# Altium schematic sheet RTL - ETH PHY.SchDoc: ETHERNET SWITCH LAYER 2
size A3; DrawnBy: Luca Schenetti; Revision: C; SheetNumber: 4; SheetTotal: 5
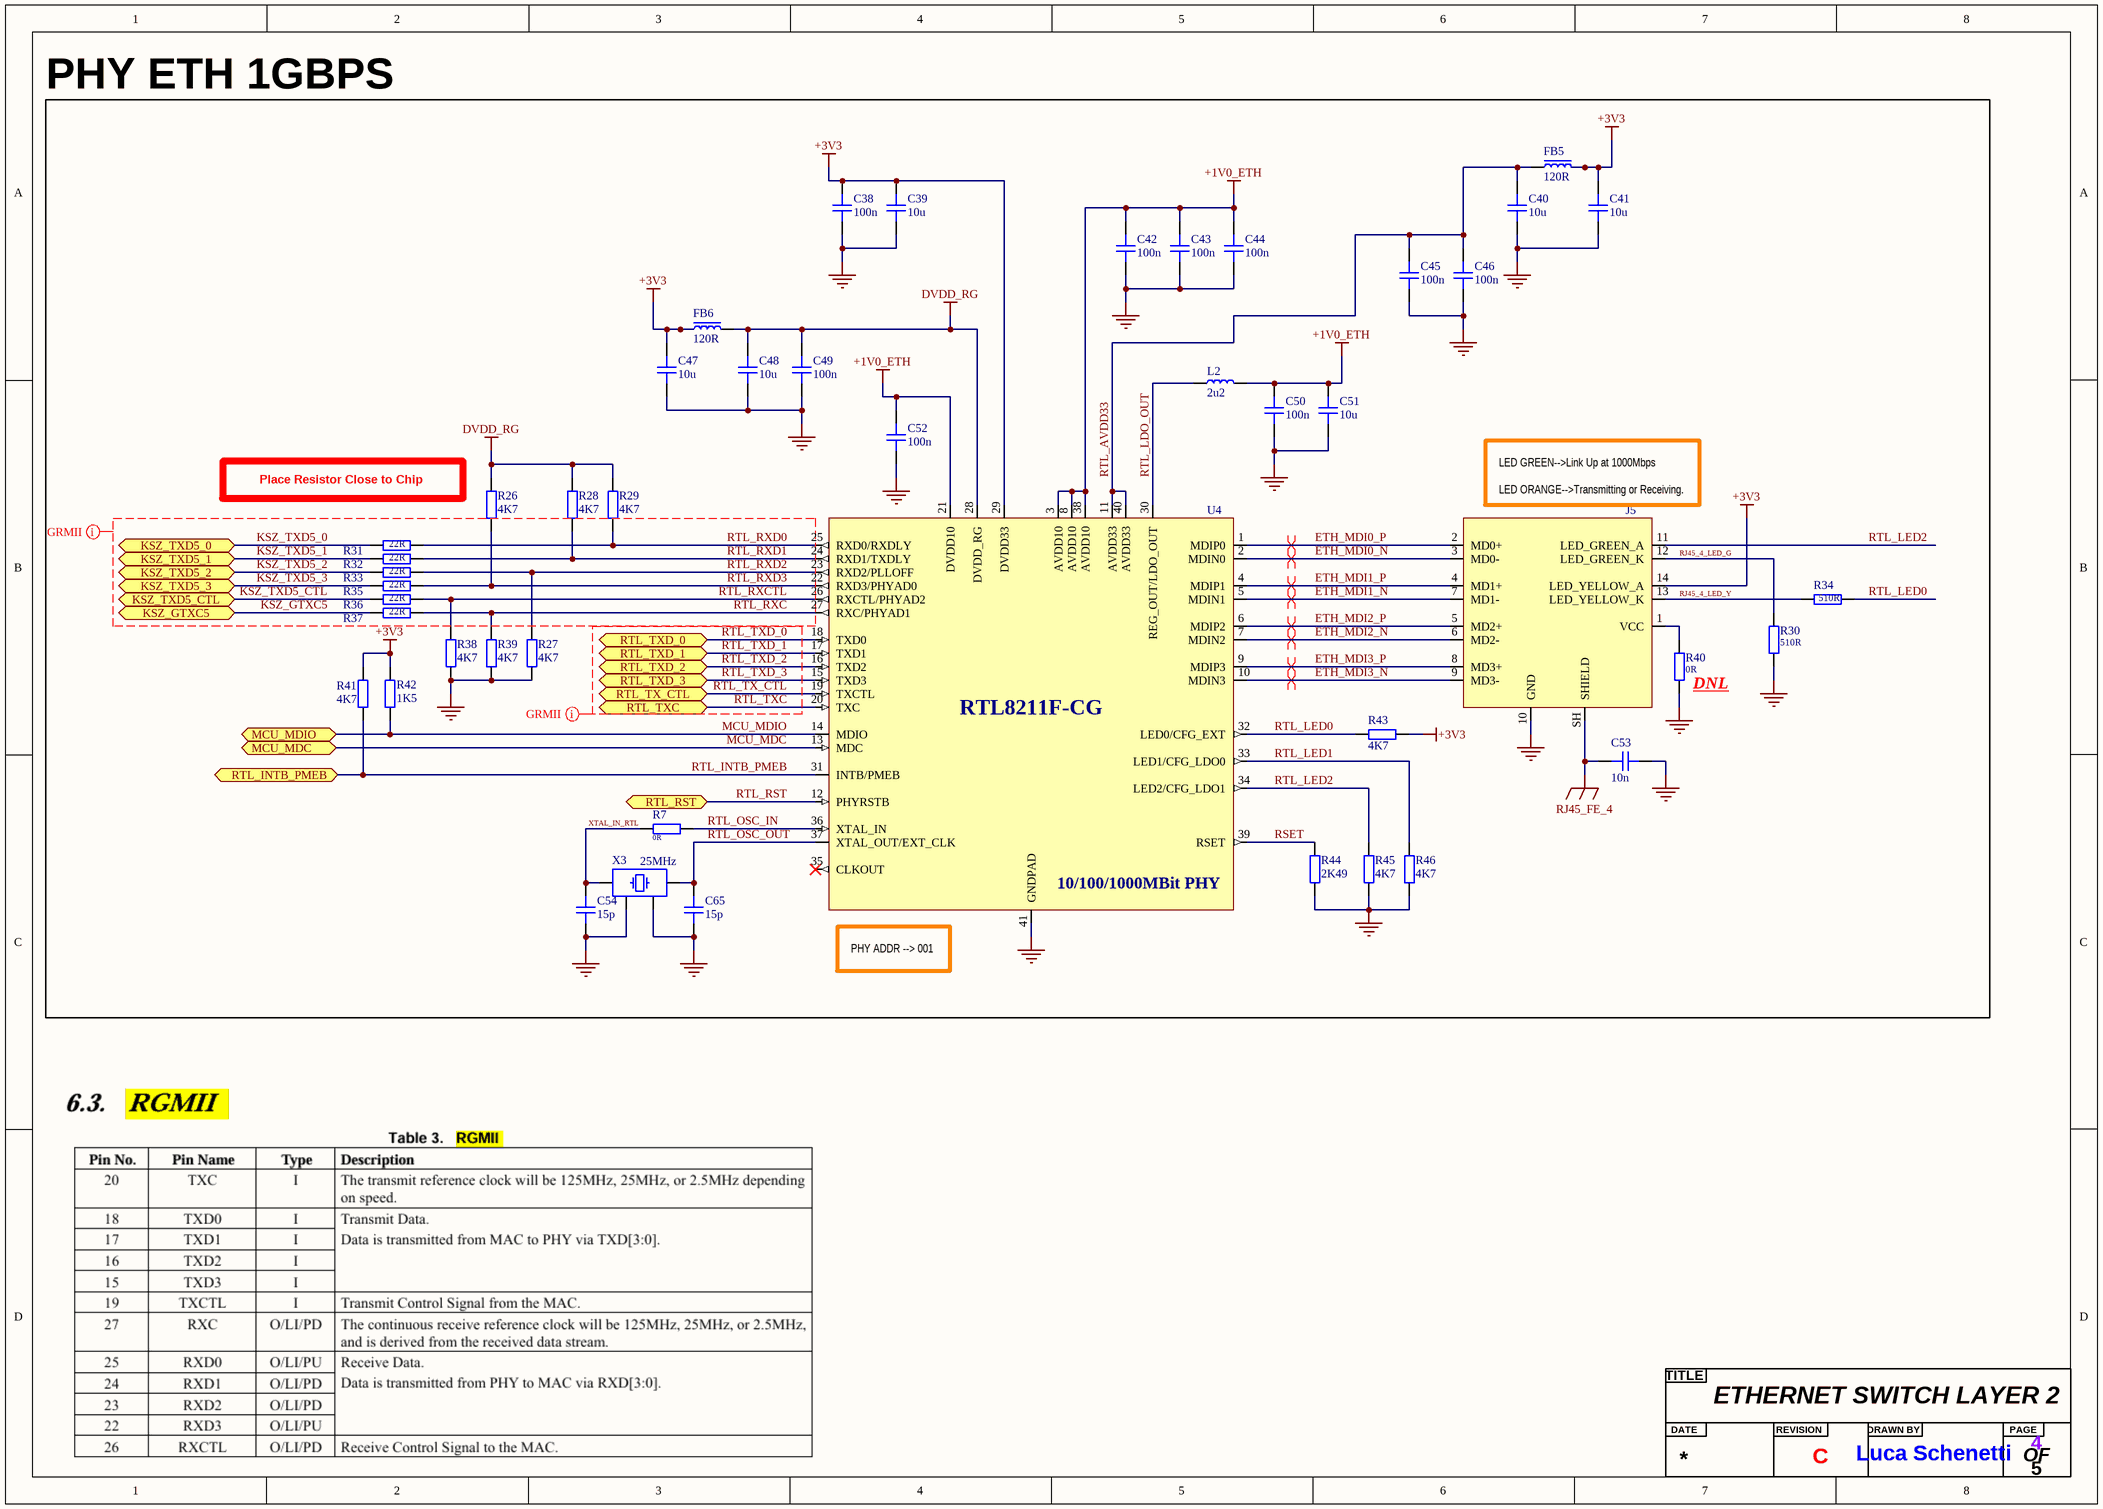
[diagram p0: RTL - ETH PHY.SchDoc]

## Parts
?  Title  (value not drawn)  (graphical)
C38  100n  [CAP_0603]
C39  10u  [CAP_0603]
C40  10u  [CAP_0603]
C41  10u  [CAP_0603]
C42  100n  [CAP_0603]
C43  100n  [CAP_0603]
C44  100n  [CAP_0603]
C45  100n  [CAP_0603]
C46  100n  [CAP_0603]
C47  10u  [CAP_0603]
C48  10u  [CAP_0603]
C49  100n  [CAP_0603]
C50  100n  [CAP_0603]
C51  10u  [CAP_0603]
C52  100n  [CAP_0603]
C53  10n  [CAP_1206]
C54  15p  [CAP_0402]
C65  15p  [CAP_0402]
FB5  120R  [FB_0603]
FB6  120R  [FB_0603]
J5  100/1000Base-T RJ45 MAGJACK  [HR911130A]  (value not drawn)
L2  2u2  [IND_1008]
R7  0R  [RES_0402]
R26  4K7  [RES_0402]
R27  4K7  [RES_0402]
R28  4K7  [RES_0402]
R29  4K7  [RES_0402]
R30  510R  [RES_0603]
R31  22R  [RES_0402]
R32  22R  [RES_0402]
R33  22R  [RES_0402]
R34  510R  [RES_0603]
R35  22R  [RES_0402]
R36  22R  [RES_0402]
R37  22R  [RES_0402]
R38  4K7  [RES_0402]
R39  4K7  [RES_0402]
R40  0R  [RES_0402]
R41  4K7  [RES_0603]
R42  1K5  [RES_0603]
R43  4K7  [RES_0603]
R44  2K49  [RES_0603]
R45  4K7  [RES_0603]
R46  4K7  [RES_0603]
U4  PHY ETH 10/100/1000M  [RTL8211F-CG]  (value not drawn)
X3  25MHz  [XTAL_3225]

## Blocks framed on the sheet
PHY ETH 1GBPS: C38-C54 C65 FB5 FB6 J5 L2 R7 R26-R46 U4 X3

## Ports
KSZ_GTXC5 (bidir, see KSZ - ETH HUB[2B]), KSZ_TXD5_0 (bidir, see KSZ - ETH HUB[2B]), KSZ_TXD5_1 (bidir, see KSZ - ETH HUB[2B]), KSZ_TXD5_2 (bidir, see KSZ - ETH HUB[2B]), KSZ_TXD5_3 (bidir, see KSZ - ETH HUB[2B]), KSZ_TXD5_CTL (bidir, see KSZ - ETH HUB[2B]), MCU_MDC (bidir, see STM32 - MCU[4C]), MCU_MDIO (bidir, see STM32 - MCU[4C]), RTL_INTB_PMEB (bidir, see STM32 - MCU[2C]), RTL_RST (bidir, see STM32 - MCU[8C]), RTL_TX_CTL (bidir, see KSZ - ETH HUB[1B]), RTL_TXC (bidir, see KSZ - ETH HUB[1B]), RTL_TXD_0 (bidir, see KSZ - ETH HUB[1B]), RTL_TXD_1 (bidir, see KSZ - ETH HUB[1B]), RTL_TXD_2 (bidir, see KSZ - ETH HUB[1B]), RTL_TXD_3 (bidir, see KSZ - ETH HUB[1B])

## Nets
+1V0_ETH: C42.2 C43.2 C44.2 C50.2 C51.2 C52.2 L2.2 U4.3(AVDD10) U4.8(AVDD10) U4.21(DVDD10) U4.38(AVDD10)
+3V3: C38.2 C39.2 C41.2 C47.2 FB5.2 FB6.2 J5.14(LED_YELLOW_A) R41.2 R42.2 R43.1 U4.29(DVDD33)
DVDD_RG: C48.2 C49.2 FB6.1 R26.2 R28.2 R29.2 U4.28(DVDD_RG)
GND: C38.1 C39.1 C40.1 C41.1 C42.1 C43.1 C44.1 C45.1 C46.1 C47.1 C48.1 C49.1 C50.1 C51.1 C52.1 C53.2 C54.1 C65.1 J5.10(GND) R27.1 R30.2 R38.1 R39.1 R40.1 R44.2 R45.2 R46.2 U4.41(GNDPAD) X3.2 X3.4
RJ45_FE_4: C53.1 J5.SH(SHIELD)
ETH_MDI0_N: J5.3(MD0-) U4.2(MDIN0)
ETH_MDI0_P: J5.2(MD0+) U4.1(MDIP0)
ETH_MDI1_N: J5.7(MD1-) U4.5(MDIN1)
ETH_MDI1_P: J5.4(MD1+) U4.4(MDIP1)
ETH_MDI2_N: J5.6(MD2-) U4.7(MDIN2)
ETH_MDI2_P: J5.5(MD2+) U4.6(MDIP2)
ETH_MDI3_N: J5.9(MD3-) U4.10(MDIN3)
ETH_MDI3_P: J5.8(MD3+) U4.9(MDIP3)
KSZ_GTXC5: R37.1 ; port KSZ_GTXC5
KSZ_TXD5_0: R31.1 ; port KSZ_TXD5_0
KSZ_TXD5_1: R32.1 ; port KSZ_TXD5_1
KSZ_TXD5_2: R33.1 ; port KSZ_TXD5_2
KSZ_TXD5_3: R35.1 ; port KSZ_TXD5_3
KSZ_TXD5_CTL: R36.1 ; port KSZ_TXD5_CTL
MCU_MDC: U4.13(MDC) ; port MCU_MDC
MCU_MDIO: R42.1 U4.14(MDIO) ; port MCU_MDIO
RJ45_4_LED_G: J5.12(LED_GREEN_K) R30.1
RJ45_4_LED_Y: J5.13(LED_YELLOW_K) R34.2
RSET: R44.1 U4.39(RSET)
RTL_AVDD33: C40.2 C45.2 C46.2 FB5.1 U4.11(AVDD33) U4.40(AVDD33)
RTL_INTB_PMEB: R41.1 U4.31(INTB/PMEB) ; port RTL_INTB_PMEB
RTL_LDO_OUT: L2.1 U4.30(REG_OUT/LDO_OUT)
RTL_LED0: R34.1 R43.2 U4.32(LED0/CFG_EXT)
RTL_LED1: R46.1 U4.33(LED1/CFG_LDO0)
RTL_LED2: J5.11(LED_GREEN_A) R45.1 U4.34(LED2/CFG_LDO1)
RTL_OSC_IN: R7.2 U4.36(XTAL_IN)
RTL_OSC_OUT: C65.2 U4.37(XTAL_OUT/EXT_CLK) X3.1
RTL_RST: U4.12(PHYRSTB) ; port RTL_RST
RTL_RXC: R37.2 R39.2 U4.27(RXC/PHYAD1)
RTL_RXCTL: R36.2 R38.2 U4.26(RXCTL/PHYAD2)
RTL_RXD0: R29.1 R31.2 U4.25(RXD0/RXDLY)
RTL_RXD1: R28.1 R32.2 U4.24(RXD1/TXDLY)
RTL_RXD2: R27.2 R33.2 U4.23(RXD2/PLLOFF)
RTL_RXD3: R26.1 R35.2 U4.22(RXD3/PHYAD0)
RTL_TX_CTL: U4.19(TXCTL) ; port RTL_TX_CTL
RTL_TXC: U4.20(TXC) ; port RTL_TXC
RTL_TXD_0: U4.18(TXD0) ; port RTL_TXD_0
RTL_TXD_1: U4.17(TXD1) ; port RTL_TXD_1
RTL_TXD_2: U4.16(TXD2) ; port RTL_TXD_2
RTL_TXD_3: U4.15(TXD3) ; port RTL_TXD_3
XTAL_IN_RTL: C54.2 R7.1 X3.3
NetJ5_1: J5.1(VCC) R40.2

Not connected (* = marked no-connect by the designer): U4 35(CLKOUT)*

## Layout directives
differential pair; differential pair class DIFF_MDI_100Ω: ETH_MDI0_N, ETH_MDI0_P, ETH_MDI1_N, ETH_MDI1_P, ETH_MDI2_N, ETH_MDI2_P, ETH_MDI3_N, ETH_MDI3_P
net class GRMII_RX; rule Matched Net Lengths [Delay Tolerance = 20ps]: KSZ_GTXC5, KSZ_TXD5_0, KSZ_TXD5_1, KSZ_TXD5_2, KSZ_TXD5_3, KSZ_TXD5_CTL, RTL_RXC, RTL_RXCTL, RTL_RXD0, RTL_RXD1, RTL_RXD2, RTL_RXD3
net class GRMII_TX; rule Matched Net Lengths [Delay Tolerance = 20ps]: RTL_TX_CTL, RTL_TXC, RTL_TXD_0, RTL_TXD_1, RTL_TXD_2, RTL_TXD_3

## Notes on the sheet
- Place Resistor Close to Chip
- (near J5) LED GREEN-->Link Up at 1000Mbps
  LED ORANGE-->Transmitting or Receiving.
- (near R40) DNL
- (near U4) PHY ADDR --> 001
- (in symbol RTL8211F-CG) 10/100/1000MBit PHY
- (in symbol Title) TITLE; DATE; REVISION; DRAWN BY; PAGE; OF

## Library data of the parts
C38 C42-C46 C49 C50 C52 = CAP_0603: Capacitor SMD 0603 [C14663]; Manufacturer: *; Manufacturer Part Number: *; Distributor Link: *; LCSC: *; Rating: *; Dielectric: *
C39-C41 C47 C48 C51 = CAP_0603: Capacitor SMD 0603 [C96446]; Manufacturer: *; Manufacturer Part Number: *; Distributor Link: *; LCSC: *; Rating: *; Dielectric: *
C53 = CAP_1206: [C1846]; Manufacturer: *; Manufacturer Part Number: *; Distributor Link: *; LCSC: *; Rating: *; Dielectric: *
C54 C65 = CAP_0402: Capacitor SMD 0402 [C1548]; Manufacturer: *; Manufacturer Part Number: *; Distributor Link: *; LCSC: *; Rating: *; Dielectric: *
FB5 FB6 = FB_0603: Ferrite Bead SMD 0603[C76892]; Manufacturer: *; Manufacturer Part Number: *; Distributor Link: *; LCSC: *
J5 = HR911130A: [C54408]; Manufacturer: Hanrun; Manufacturer Part Number: HR911130A
L2 = IND_1008: [C3002540]
R7 = RES_0402: Resistor SMD 0402 [C17168]; Manufacturer: *; Manufacturer Part Number: *; Distributor Link: *; LCSC: *
R26-R29 R38 R39 = RES_0402: [C25900]; Manufacturer: *; Manufacturer Part Number: *; Distributor Link: *; LCSC: *
R30 R34 = RES_0603: [C23193]; Manufacturer: *; Manufacturer Part Number: *; Distributor Link: *; LCSC: *
R31-R33 R35-R37 = RES_0402: Resistor SMD 0402 [C25092]; Manufacturer: *; Manufacturer Part Number: *; Distributor Link: *; LCSC: *
R40 = RES_0402: Resistor SMD 0402; Manufacturer: *; Manufacturer Part Number: *; Distributor Link: *; LCSC: *
R41 R43 R45 R46 = RES_0603: [C23162]; Manufacturer: *; Manufacturer Part Number: *; Distributor Link: *; LCSC: *
R42 = RES_0603: [C22843]; Manufacturer: *; Manufacturer Part Number: *; Distributor Link: *; LCSC: *
R44 = RES_0603: [C22908]; Manufacturer: *; Manufacturer Part Number: *; Distributor Link: *; LCSC: *
U4 = RTL8211F-CG: [C187932]; Manufacturer: Realtek; Manufacturer Part Number: RTL8211F-CG
X3 = TSX-3225_24.0000MF15X-AC: Crystal SMD 24MHz 10PPM 7pF 3225 [C9006]; Manufacturer: Epson; Manufacturer Part Number: TSX-3225 24.0000MF15X-AC